# EAGLE design watch-pcb (EAGLE 6.2)
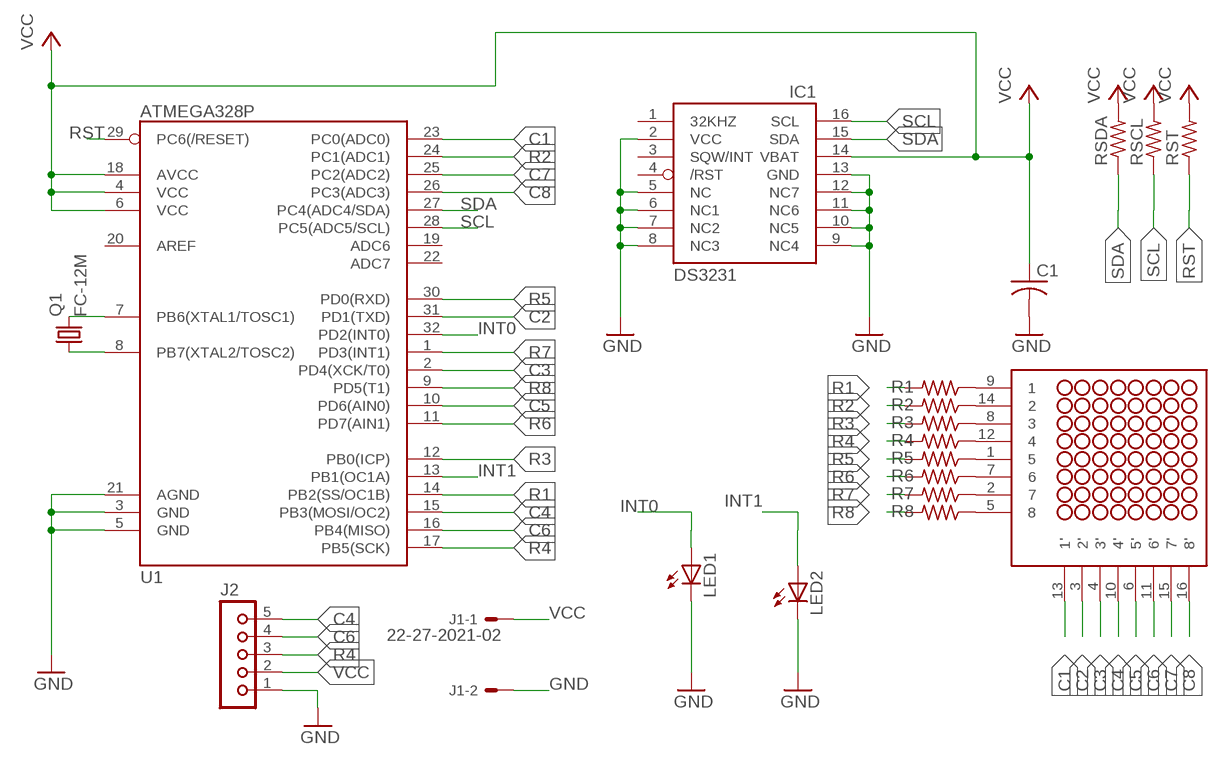
[diagram p0: schematic, sheet 1]

## Parts
C1  C-USC0805K  [C0805K]
IC1  DS3231/SO  [SO16W]
J1  22-27-2021-02  [6410-02]
J2  JU05  [JU05]
LED1  LED5MM  [LED5MM]
LED2  LED5MM  [LED5MM]
Q1  FC-12M  [FC-12M]
R1  R-US_M1406  [M1406]
R2  R-US_M1406  [M1406]
R3  R-US_M1406  [M1406]
R4  R-US_M1406  [M1406]
R5  R-US_M1406  [M1406]
R6  R-US_M1406  [M1406]
R7  R-US_M1406  [M1406]
R8  R-US_M1406  [M1406]
RSCL  R-US_M1406  [M1406]
RSDA  R-US_M1406  [M1406]
RST  R-US_M1406  [M1406]
U1  ATMEGA328P  ATMEGA328_SMT  [TQFP32-08]
U$1  NFM-12881BG-11  [NFM-12881BG-11]

## Nets
C1: U1.23(PC0(ADC0)) U$1.13(1')
C2: U1.31(PD1(TXD)) U$1.3(2')
C3: U1.2(PD4(XCK/T0)) U$1.4(3')
C4: J2.5 U1.15(PB3(MOSI/OC2)) U$1.10(4')
C5: U1.10(PD6(AIN0)) U$1.6(5')
C6: J2.4 U1.16(PB4(MISO)) U$1.11(6')
C7: U1.25(PC2(ADC2)) U$1.15(7')
C8: U1.26(PC3(ADC3)) U$1.16(8')
GND: C1.2 IC1.2(VCC) IC1.5(NC) IC1.6(NC1) IC1.7(NC2) IC1.8(NC3) IC1.9(NC4) IC1.10(NC5) IC1.11(NC6) IC1.12(NC7) IC1.13(GND) J1.2 J2.1 LED1.K(C) LED2.K(C) U1.3(GND) U1.5(GND) U1.21(AGND)
INT0: LED1.A U1.32(PD2(INT0))
INT1: LED2.A U1.13(PB1(OC1A))
N$1: R1.1 U$1.9
N$2: R2.1 U$1.14
N$3: R3.1 U$1.8
N$4: R4.1 U$1.12
N$5: R5.1 U$1.1
N$6: R6.1 U$1.7
N$7: R7.1 U$1.2
N$8: R8.1 U$1.5
N$14: Q1.2 U1.7(PB6(XTAL1/TOSC1))
N$15: Q1.1 U1.8(PB7(XTAL2/TOSC2))
R1: R1.2 U1.14(PB2(SS/OC1B))
R2: R2.2 U1.24(PC1(ADC1))
R3: R3.2 U1.12(PB0(ICP))
R4: J2.3 R4.2 U1.17(PB5(SCK))
R5: R5.2 U1.30(PD0(RXD))
R6: R6.2 U1.11(PD7(AIN1))
R7: R7.2 U1.1(PD3(INT1))
R8: R8.2 U1.9(PD5(T1))
RST: RST.1 U1.29(PC6(/RESET))
SCL: IC1.16(SCL) RSCL.1 U1.28(PC5(ADC5/SCL))
SDA: IC1.15(SDA) RSDA.1 U1.27(PC4(ADC4/SDA))
VCC: C1.1 IC1.14(VBAT) J1.1 J2.2 RSCL.2 RSDA.2 RST.2 U1.4(VCC) U1.6(VCC) U1.18(AVCC)
Unconnected: IC1.1(32KHZ) IC1.3(SQW/INT) IC1.4(/RST) U1.19(ADC6) U1.20(AREF) U1.22(ADC7)

## Library data of the parts
C1 = adafruit:C-US: CAPACITOR, American symbol
IC1 = adafruit:DS3231
J1 = con-molex:22-?-02: CONNECTOR wire to board 2.54 mm (.1 inch) pitch header; OC_FARNELL: unknown; OC_NEWARK: unknown
J2 = con-lsta:JU05: PIN HEADER; OC_FARNELL: unknown; OC_NEWARK: unknown
LED1 LED2 = led:LED: LED OSRAM: - CHIPLED LG R971, LG N971, LY N971, LG Q971, LY Q971, LO R971, LY R971 LH N974, LH R974 LS Q976, LO Q976, LY Q976 LO Q996 - Hyper CHIPLED LW Q18S LB Q993, LB Q99A, LB R99A - SideLED LS A670, LO A670, LY A670, LG A670, LP A670 LB A673, LV A673, LT A673, LW A673 LH A674 LY A675 LS A676, LA A676, LO A676, LY A676, LW A676 LS A679, LY A679, LG A679 - Hyper Micro SIDELED® LS Y876, LA Y876, LO Y876, LY Y876 LT Y87S - SmartLED LW L88C, LW L88S LB L89C, LB L89S, LG L890 LS L89K, LO L89K, LY L89K LS L896, LA L896, LO L896, LY L896 - TOPLED LS T670, LO T670, LY T670, LG T670, LP T670 LSG T670, LSP T670, LSY T670, LOP T670, LYG T670 LG T671, LOG T671, LSG T671 LB T673, LV T673, LT T673, LW T673 LH T674 LS T676, LA T676, LO T676, LY T676, LB T676, LH T676, LSB T676, LW T676 LB T67C, LV T67C, LT T67C, LS T67K, LO T67K, LY T67K, LW E67C LS E67B, LA E67B, LO E67B, LY E67B, LB E67C, LV E67C, LT E67C LW T67C LS T679, LY T679, LG T679 LS T770, LO T770, LY T770, LG T770, LP T770 LB T773, LV T773, LT T773, LW T773 LH T774 LS E675, LA E675, LY E675, LS T675 LS T776, LA T776, LO T776, LY T776, LB T776 LHGB T686 LT T68C, LB T68C - Hyper Mini TOPLED® LB M676 - Mini TOPLED Santana® LG M470 LS M47K, LO M47K, LY M47K Source: http://www.osram.convergy.de LUXEON: - LUMILED® LXK2-PW12-R00, LXK2-PW12-S00, LXK2-PW14-U00, LXK2-PW14-V00 LXK2-PM12-R00, LXK2-PM12-S00, LXK2-PM14-U00 LXK2-PE12-Q00, LXK2-PE12-R00, LXK2-PE12-S00, LXK2-PE14-T00, LXK2-PE14-U00 LXK2-PB12-K00, LXK2-PB12-L00, LXK2-PB12-M00, LXK2-PB14-N00, LXK2-PB14-P00, LXK2-PB14-Q00 LXK2-PR12-L00, LXK2-PR12-M00, LXK2-PR14-Q00, LXK2-PR14-R00 LXK2-PD12-Q00, LXK2-PD12-R00, LXK2-PD12-S00 LXK2-PH12-R00, LXK2-PH12-S00 LXK2-PL12-P00, LXK2-PL12-Q00, LXK2-PL12-R00 Source: www.luxeon.com KINGBRIGHT: KA-3528ASYC Source: www.kingbright.com
Q1 = crystal:FC-12M: kHz RANGE CRYSTAL UNIT LOW PROFILE SMD Source: Epson Toyocom FC-12M.pdf
R1-R8 RSCL RSDA RST = adafruit:R-US_: RESISTOR, American symbol
U1 = SparkFun-DigitalIC:ATMEGA328_SMT: 32-Pin Atmega328 part Commonly used on Arduino compatible boards Available in QFP and QFN packages TQFP is IC-09069 QFN is non-stock; PROD_ID: IC-09069
U$1 = eagle-library-edeca.net-v5:NFM-12881BG-11: Futurlec 8x8 LED Matrix

## Board
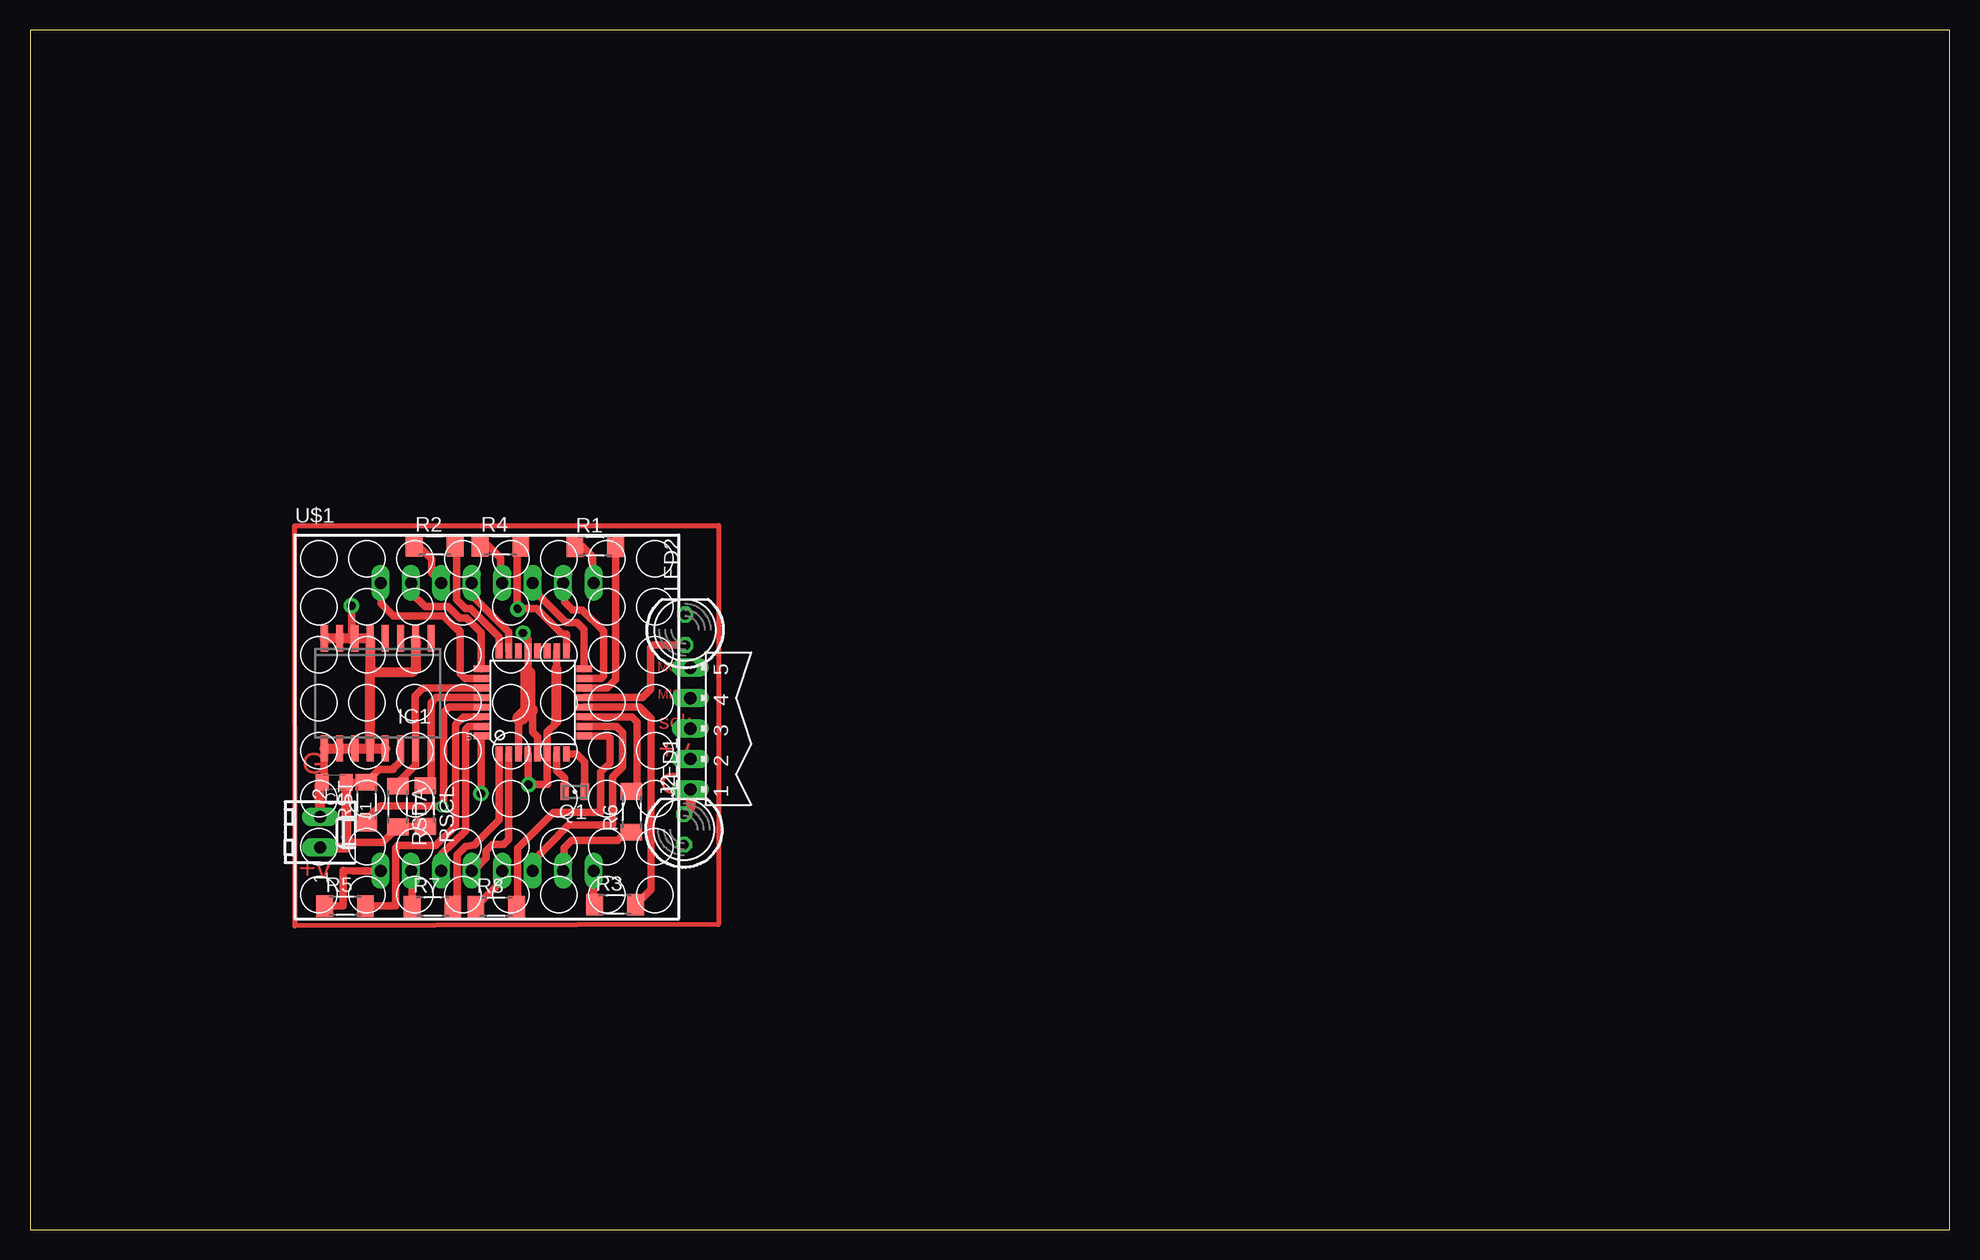
[diagram p1: board, top side]
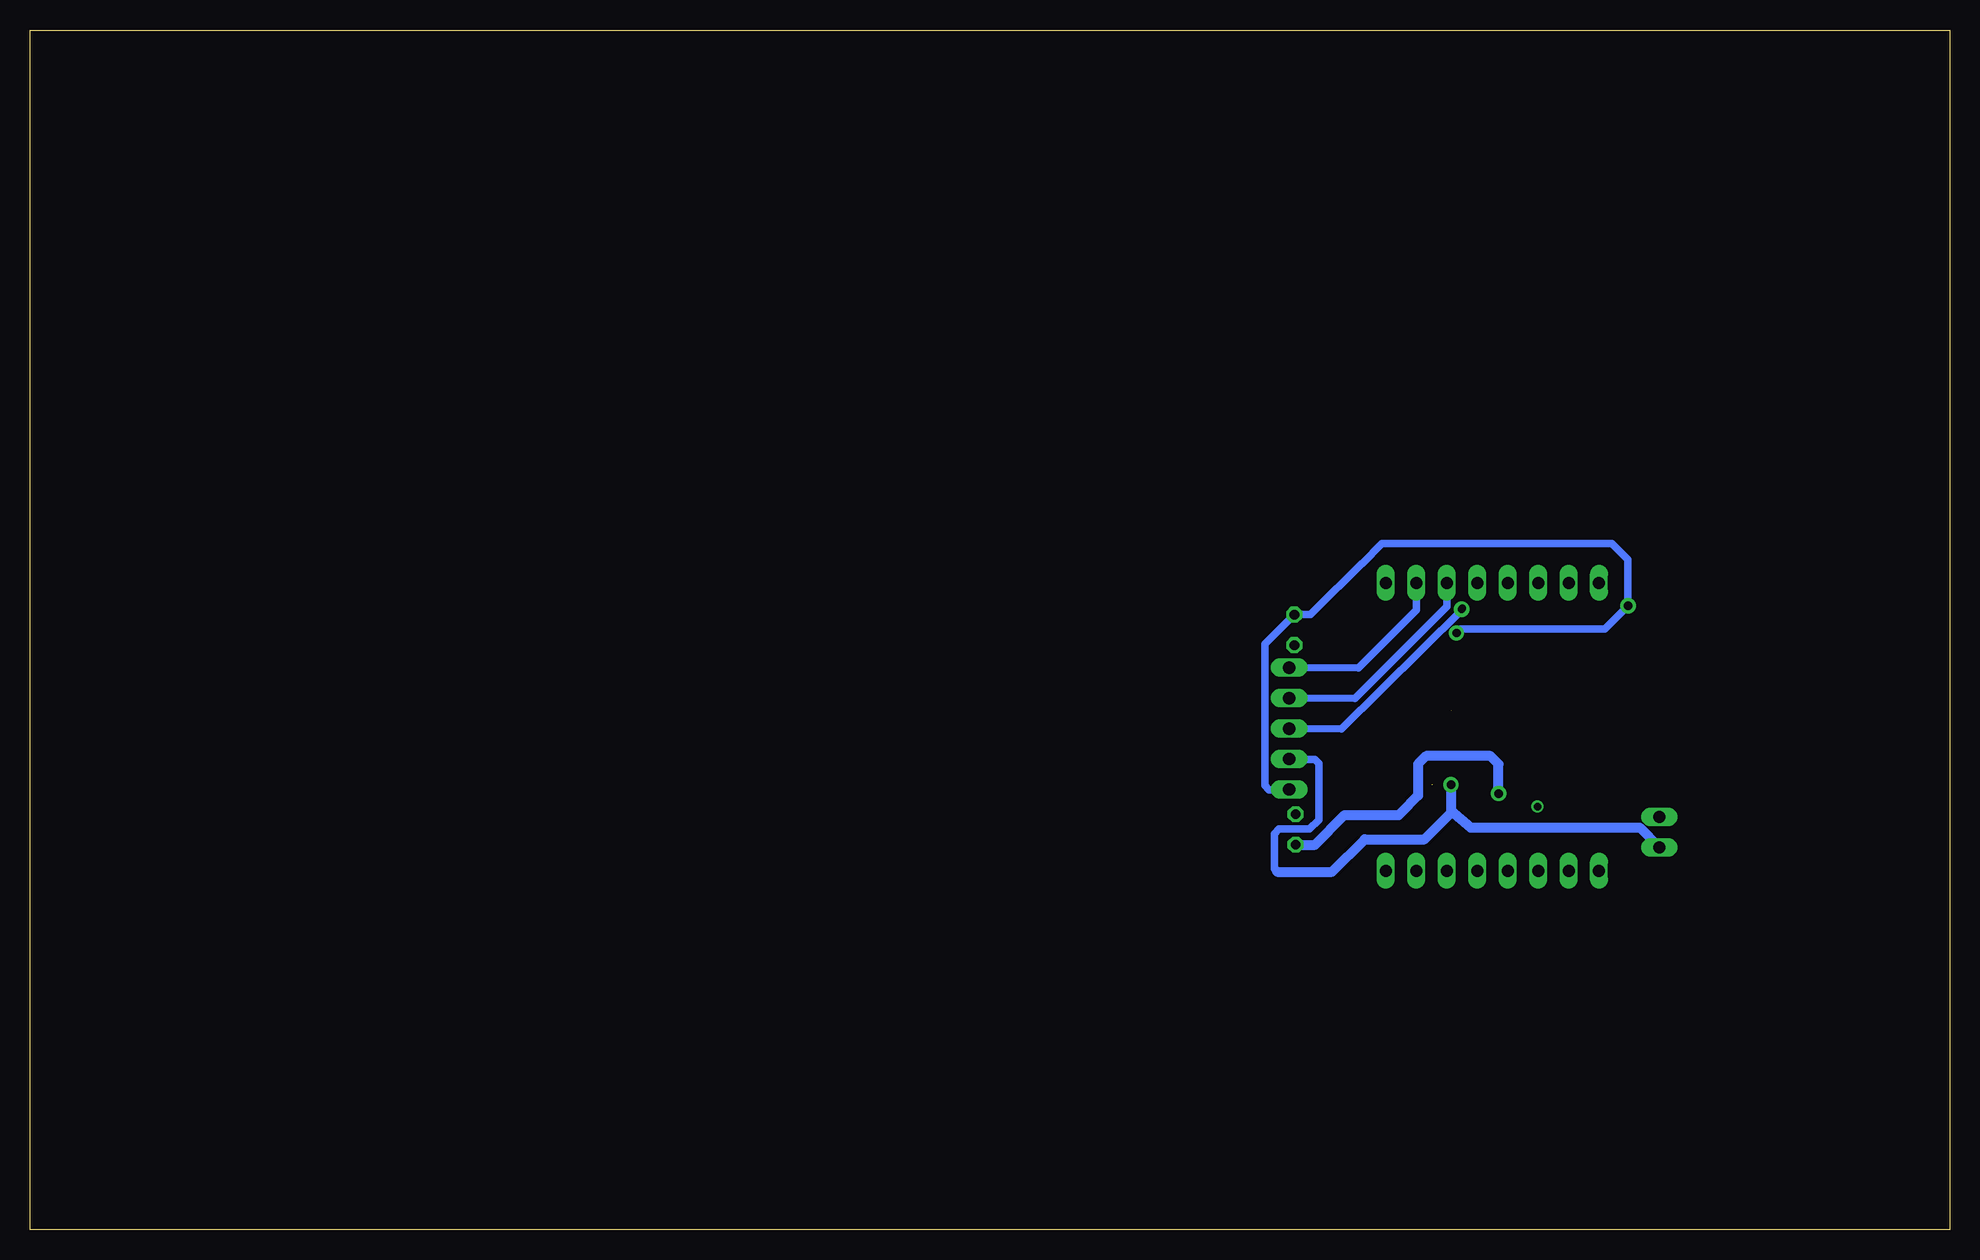
[diagram p2: board, bottom side, seen from below]

Size 160 x 100 mm. Coordinates in mm from the lower left corner, seen from the top.
Outline: 0,0 160,0 160,100 0,100 0,0
Copper layers (1*16): Top 0.035mm / dielectric 1.5mm / Bottom 0.035mm
Design rules: minimum track width 10mil, minimum drill 24mil, track to track 8mil, track to pad 8mil, pad to pad 8mil, via to via 8mil, smd to smd 8mil, copper to edge 40mil, drill to drill 8mil, minimum pad ring 10mil, minimum via ring 8mil, stop-mask expansion 4mil, vias tented up to drill 0mil, thermal gap 10mil

### Footprints (pad centres in the part's own frame; a part is rotated, then mirrored left to right if it is on the bottom)
C0805K = smd 1.1 x 1.4: 1 -1,0; 2 1,0
SO16W = smd 0.6 x 2.2: 1 -4.445,-4.6; 2 -3.175,-4.6; 3 -1.905,-4.6; 4 -0.635,-4.6; 5 0.635,-4.6; 6 1.905,-4.6; 7 3.175,-4.6; 8 4.445,-4.6; 9 4.445,4.6; 10 3.175,4.6; 11 1.905,4.6; 12 0.635,4.6; 13 -0.635,4.6; 14 -1.905,4.6; 15 -3.175,4.6; 16 -4.445,4.6
6410-02 = drill 1.016 long: 1 1.27,0; 2 -1.27,0
JU05 = drill 1.016 long: 1 -5.08,0; 2 -2.54,0; 3 0,0; 4 2.54,0; 5 5.08,0
LED5MM = drill 0.813 octagon: A -1.27,0; K 1.27,0
FC-12M = smd 0.7 x 1.4: 1 -0.85,0; 2 0.85,0
M1406 = smd 1.4 x 1.8: 1 -1.7,0; 2 1.7,0
TQFP32-08 = smd 1.27 x 0.559: 1 -4.293,2.8; 2 -4.293,2; 3 -4.293,1.2; 4 -4.293,0.4; 5 -4.293,-0.4; 6 -4.293,-1.2; 7 -4.293,-2; 8 -4.293,-2.8; 17 4.293,-2.8; 18 4.293,-2; 19 4.293,-1.2; 20 4.293,-0.4; 21 4.293,0.4; 22 4.293,1.2; 23 4.293,2; 24 4.293,2.8 | smd 0.559 x 1.27: 9 -2.8,-4.293; 10 -2,-4.293; 11 -1.2,-4.293; 12 -0.4,-4.293; 13 0.4,-4.293; 14 1.2,-4.293; 15 2,-4.293; 16 2.8,-4.293; 25 2.8,4.293; 26 2,4.293; 27 1.2,4.293; 28 0.4,4.293; 29 -0.4,4.293; 30 -1.2,4.293; 31 -2,4.293; 32 -2.8,4.293
NFM-12881BG-11 = drill 1 long: 1 -8.89,-12; 2 -6.35,-12; 3 -3.81,-12; 4 -1.27,-12; 5 1.27,-12; 6 3.81,-12; 7 6.35,-12; 8 8.89,-12; 9 8.89,12; 10 6.35,12; 11 3.81,12; 12 1.27,12; 13 -1.27,12; 14 -3.81,12; 15 -6.35,12; 16 -8.89,12

### Placement (x,y rotation side)
C1  25.35,37.29 180 top
IC1  28.98,44.7 180 top
J1  24.18,33.12 270 top
J2  55.04,41.76 90 top
LED1  54.51,33.35 90 top
LED2  54.61,49.99 90 top
Q1  45.42,36.5 180 top
R1  47.12,56.95 0 top
R2  33.73,57.02 0 top
R3  48.77,27.08 0 top
R4  39.22,57.02 0 top
R5  26.26,26.97 0 top
R6  50.14,34.82 90 top
R7  33.55,26.92 0 top
R8  38.86,26.9 0 top
RSCL  32.94,35.31 270 top
RSDA  30.66,35.26 270 top
RST  28.04,35.59 90 top
U1  41.91,43.94 90 top
U$1  38.1,41.91 0 top

### Tracks (layer width: path | path; a pad name or v marks a point on that pad's centre or on a via)
C1
  Top 0.61: U1.23 39.91,49.8 36.88,52.83 36.88,53.86 U$1.13
C2
  Top 0.61: U1.31 36.56,41.94 36.32,41.71 36.32,34.01 | 36.32,34.01 36.32,33.78 | U$1.3 34.31,29.89 34.31,31.29 36.3,33.22 36.3,33.93 36.32,34.01
C3
  Top 0.61: U$1.4 36.97,29.91 38.02,30.96 38.02,31.55 38.58,32.11 39.5,32.11 39.9,32.51 U1.2
C4
  Top 0.61: U1.15 47.62,45.94 47.8,46.13 47.8,49.89 46.02,51.66 45.24,51.66 44.58,52.32 44.58,53.78 U$1.10
  Bottom 0.61: U$1.10 44.45,54.36 U$1.10 | U$1.10 44.45,51.64 49.28,46.81 J2.5
C5
  Top 0.61: U1.10 48.89,41.94 49.4,41.43 49.4,38.56 48.56,37.72 48.56,33.73 44.91,33.73 43.13,31.95 41.96,30.79 41.96,29.96 U$1.6
C6
  Top 0.61: U1.16 46.2,50.01 45.59,50.62 44.7,50.62 42.04,53.29 42.04,53.78 U$1.11
  Bottom 0.61: J2.4 49.55,44.27 41.88,51.94 41.88,53.88 U$1.11
C7
  Top 0.61: U1.25 37.62,48.34 37.62,49.76 36.4,50.98 35.81,50.98 34.87,51.92 32.92,51.92 31.73,53.11 31.73,53.88 U$1.15 31.88,53.78
C8
  Top 0.61: U1.26 36.28,45.94 35.87,46.35 35.87,48.74 35.87,49.86 35.71,50.01 35.59,50.01 34.47,51.13 30.3,51.13 29.26,52.17 29.26,53.86 U$1.16
GND  (via drill 0.6, 0.7 pad 1.27)  (1 unrouted)
  Top 0.61: U1.21 41.51,43.48 | 41.51,43.48 41.51,43.29 | 40.84,42.62 40.77,42.62 40.71,42.56 U1.3 | U1.21 41.51,43.48 | 41.08,49.68 v41.1,49.73 41.51,49.24 U1.21 | v26.8,51.99 26.8,49.08 IC1.6 | IC1.9 24.54,37.47 C1.2 | U1.5 42.31,41.08 41.91,41.48 41.91,43.07 41.69,43.28
  Top 0.813: IC1.8 IC1.7 IC1.6 IC1.5 28.37,46.58 28.4,46.48 | 28.4,46.48 31.93,46.48 32.21,46.74 32.21,48.87 IC1.2 | IC1.9 IC1.10 IC1.11 IC1.12 | IC1.12 IC1.13 | IC1.12 28.37,46.38 28.4,46.48 | J1.2 24.16,37.17 C1.2 | J2.1 v55.04,36.65 55.04,35.15 LED1.K
  Top 1.27: 41.51,43.48 41.51,46.35 41.5,46.35 | 41.5,43.28 41.69,43.28 | 40.84,42.62 41.51,43.29
  Bottom 0.61: v41.1,49.73 40.77,50.06 28.73,50.06 v26.8,51.99 26.82,52.02 26.82,55.85 28.14,57.17 47.3,57.17 48.95,55.52 49,55.52 53.01,51.51 53.26,51.26 LED2.K 57.07,48.79 57.07,37.01 56.72,36.65 v55.04,36.65
INT0  (via drill 0.7 pad 1.27)
  Top 0.61: U1.32 37.62,36.37 v37.59,36.35
  Bottom 0.813: v37.59,36.35 37.59,38.81 38.25,39.47 43.64,39.47 44.3,38.81 44.3,36.35 44.3,36.17 45.77,34.7 45.92,34.54 50.42,34.54 52.88,32.08 LED1.A
INT1
  Top 0.61: U1.13 51.07,44.34 51.74,45.01 51.74,48.54 51.94,48.74 54.99,48.74 LED2.A
N$1
  Top 0.61: R1.1 46.08,56.95 46.91,56.11 46.91,53.99 U$1.9
N$2
  Top 0.61: R2.1 32.33,57.02 33.48,55.88 33.48,54.72 U$1.14
N$3
  Top 0.61: U$1.8 46.99,27.15 R3.1
N$4
  Top 0.61: R4.1 38.18,57.02 39.22,55.98 39.22,54.06 U$1.12
N$5
  Top 0.61: U$1.1 26.94,29.91 26.09,29.92 26.09,26.98 R5.1
N$6
  Top 0.61: R6.1 49.68,33.12 49,32.44 45.14,32.44 44.53,31.83 44.53,29.99 U$1.7
N$7
  Top 0.61: R7.1 31.85,29.81 U$1.2
N$8
  Top 0.61: U$1.5 39.37,29.11 R8.1
N$9
  Top 0.406: 22.05,58.67 57.4,58.7 57.38,25.43 22.1,25.3 22.05,58.67
N$11
  Top 0.61: 34.24,29.9 34.24,28.88
N$12  (via drill 0.6)
  other vias: 34.34,35.26
N$13  (via drill 0.6 pad 1.27)
  other vias: 40.67,51.71
N$14
  Top 0.61: U1.7 43.91,38.28 44.55,37.64 44.55,36.51 Q1.2
N$15
  Top 0.61: U1.8 45.54,39.65 46.23,38.96 46.23,36.54 Q1.1
R1
  Top 0.61: U1.14 48.09,45.14 48.79,45.85 48.79,56.92 R1.2
R2
  Top 0.61: U1.24 39.11,49.38 36.73,51.77 36.3,51.77 35.56,52.5 35.56,56.89 R2.2
R3
  Top 0.61: U1.12 50.82,43.54 51.77,42.6 51.77,28.37 R3.2
R4  (via drill 0.6)
  Top 0.61: U1.17 44.71,49.6 44.68,49.63 44.37,49.63 42.22,51.79 v40.62,51.79 40.62,56.72 R4.2
  Bottom 0.61: J2.3 50.67,41.73 40.64,51.66 40.62,51.69 v40.62,51.79
R5
  Top 0.61: U1.30 36.14,42.74 35.48,42.09 35.48,33.63 33.83,32 30.66,32 30.61,31.95 30.48,31.83 30.48,27.23 | 30.48,27.23 30.48,26.98 | 30.48,27.23 30.23,26.98 R5.2
R6
  Top 0.61: U1.11 50.2,42.74 50.62,42.32 50.62,37.01 R6.2
R7
  Top 0.61: U1.1 39.11,34.13 37.41,32.44 37.06,32.08 36.32,31.95 35.59,31.22 35.59,28.17 35.59,27.26 R7.2 35.48,26.92 35.56,26.85 35.56,26.87 35.48,26.95
R8
  Top 0.61: U1.9 48.14,41.14 48.34,40.95 48.34,38.91 47.57,38.15 47.57,34.77 43.64,34.77 40.64,31.77 40.64,26.98 R8.2
RST
  Top 0.61: U1.29 34.93,43.54 34.49,43.1 34.49,37.74 34.49,35.94 34.44,35.31 29.18,35.31 28.04,34.16 RST.1
SCL
  Top 0.61: U1.28 33.85,44.34 33.43,43.92 IC1.16 33.43,37.49 RSCL.1
SDA
  Top 0.61: U1.27 32.77,45.14 32.11,44.48 IC1.15 32.16,38.73 30.63,37.21 RSDA.1
VCC  (via drill 0.7 pad 1.27)  (1 unrouted)
  Top 0.61: U1.4 41.51,37.45 v41.55,37.08 43.13,37.08 | 43.11,37.12 U1.6 43.11,41.46 43.89,42.24 43.84,42.29 | RSCL.2 30.71,33.61 | 30.71,33.61 RSDA.2 | 30.71,33.61 30.71,33.58 29.41,32.28 26.77,32.26 | IC1.14 30.89,39.04 30.28,38.43 30.28,38.38 30.25,38.35 29.11,38.35 RST.2 | C1.1 RST.2 | RST.2 26.39,37.28 26.34,37.24 | U1.18 43.91,46.78 43.87,46.74
  Top 0.813: J1.1 26.36,31.85 26.77,32.26 26.34,32.69 26.34,37.24 | 43.87,46.74 43.87,42.32 43.84,42.29
  Bottom 0.61: J2.2 56.03,39.19 52.91,39.19 52.58,38.86 52.58,34.14 53.34,33.38 55.91,33.38 56.29,32.99 56.29,30.07 56.03,29.82
  Bottom 0.813: J1.1 25.83,33.5 39.9,33.5 41.55,34.95 v41.55,37.08 41.55,37.11 41.55,34.75 43.76,32.54 48.74,32.54 51.46,29.82 56.03,29.82

### Text on the board
Top: MOSI | MISO | sck | +v | G | G | +v